# Altium schematic sheet GPIO_Breakout.SchDoc
size Letter; Organization: Altium Limited; Address1: L3, 12a Rodborough Rd; Address2: Frenchs Forest; Address3: NSW; Address4: Australia 2086
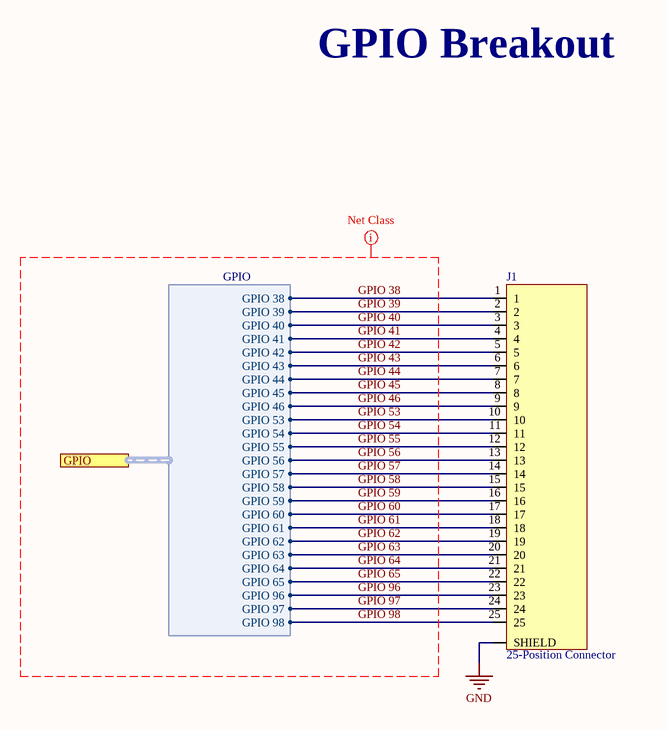
[diagram p0: GPIO_Breakout.SchDoc]

## Parts
J1  25-Position Connector  [25-POS D-SUB]

## Ports
GPIO (harness GPIO)

## Harnesses
GPIO: GPIO 38, GPIO 39, GPIO 40, GPIO 41, GPIO 42, GPIO 43, GPIO 44, GPIO 45, GPIO 46, GPIO 53, GPIO 54, GPIO 55, GPIO 56, GPIO 57, GPIO 58, GPIO 59, GPIO 60, GPIO 61, GPIO 62, GPIO 63, GPIO 64, GPIO 65, GPIO 96, GPIO 97, GPIO 98

## Nets
GND: J1.SHIELD
GPIO 38: J1.1 ; port GPIO.GPIO 38
GPIO 39: J1.2 ; port GPIO.GPIO 39
GPIO 40: J1.3 ; port GPIO.GPIO 40
GPIO 41: J1.4 ; port GPIO.GPIO 41
GPIO 42: J1.5 ; port GPIO.GPIO 42
GPIO 43: J1.6 ; port GPIO.GPIO 43
GPIO 44: J1.7 ; port GPIO.GPIO 44
GPIO 45: J1.8 ; port GPIO.GPIO 45
GPIO 46: J1.9 ; port GPIO.GPIO 46
GPIO 53: J1.10 ; port GPIO.GPIO 53
GPIO 54: J1.11 ; port GPIO.GPIO 54
GPIO 55: J1.12 ; port GPIO.GPIO 55
GPIO 56: J1.13 ; port GPIO.GPIO 56
GPIO 57: J1.14 ; port GPIO.GPIO 57
GPIO 58: J1.15 ; port GPIO.GPIO 58
GPIO 59: J1.16 ; port GPIO.GPIO 59
GPIO 60: J1.17 ; port GPIO.GPIO 60
GPIO 61: J1.18 ; port GPIO.GPIO 61
GPIO 62: J1.19 ; port GPIO.GPIO 62
GPIO 63: J1.20 ; port GPIO.GPIO 63
GPIO 64: J1.21 ; port GPIO.GPIO 64
GPIO 65: J1.22 ; port GPIO.GPIO 65
GPIO 96: J1.23 ; port GPIO.GPIO 96
GPIO 97: J1.24 ; port GPIO.GPIO 97
GPIO 98: J1.25 ; port GPIO.GPIO 98

## Layout directives
net class GPIO: GPIO 38, GPIO 39, GPIO 40, GPIO 41, GPIO 42, GPIO 43, GPIO 44, GPIO 45, GPIO 46, GPIO 53, GPIO 54, GPIO 55, GPIO 56, GPIO 57, GPIO 58, GPIO 59, GPIO 60, GPIO 61, GPIO 62, GPIO 63, GPIO 64, GPIO 65, GPIO 96, GPIO 97, GPIO 98

## Notes on the sheet
- GPIO Breakout
- Title
- Size:
- Date:
- Letter
- Number:
- Time:
- Revision:
- Sheet
- of
- File:

## Library data of the parts
J1 = 25-Position Connector: Manufacturer Part Number: 772-E25-213R051; DigiKey Part Number: NOR1066-ND